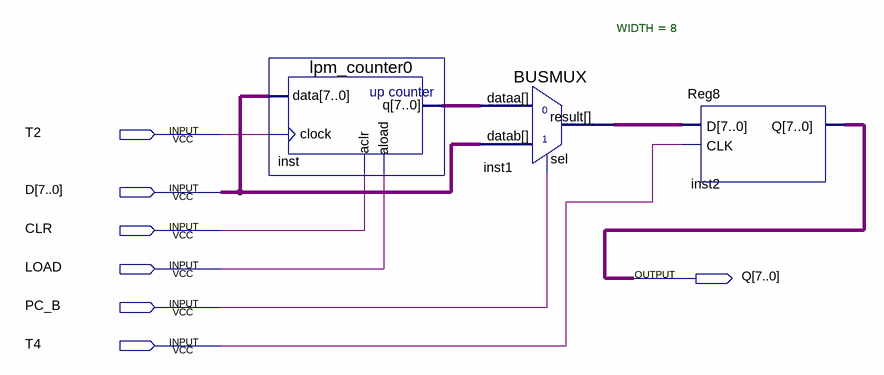
[diagram p0: schematic sheet]
// Quartus schematic PC_AR1021.bdf as structural Verilog: 3 symbols, 7 pins
module PC_AR1021 (
  input  T2,
  input  [7:0] D,
  input  CLR,
  input  LOAD,
  input  PC_B,
  input  T4,
  output [7:0] Q
);

  wire [7:0] inst1_result, inst_q;

  lpm_counter0 inst (.data(D), .clock(T2), .aclr(CLR), .aload(LOAD), .q(inst_q));
  BUSMUX #(.WIDTH(8)) inst1 (.datab(D), .sel(PC_B), .dataa(inst_q), .result(inst1_result));
  Reg8 inst2 (.D(inst1_result), .CLK(T4), .Q(Q));
endmodule
